# Altium schematic sheet Processor.SchDoc
size A
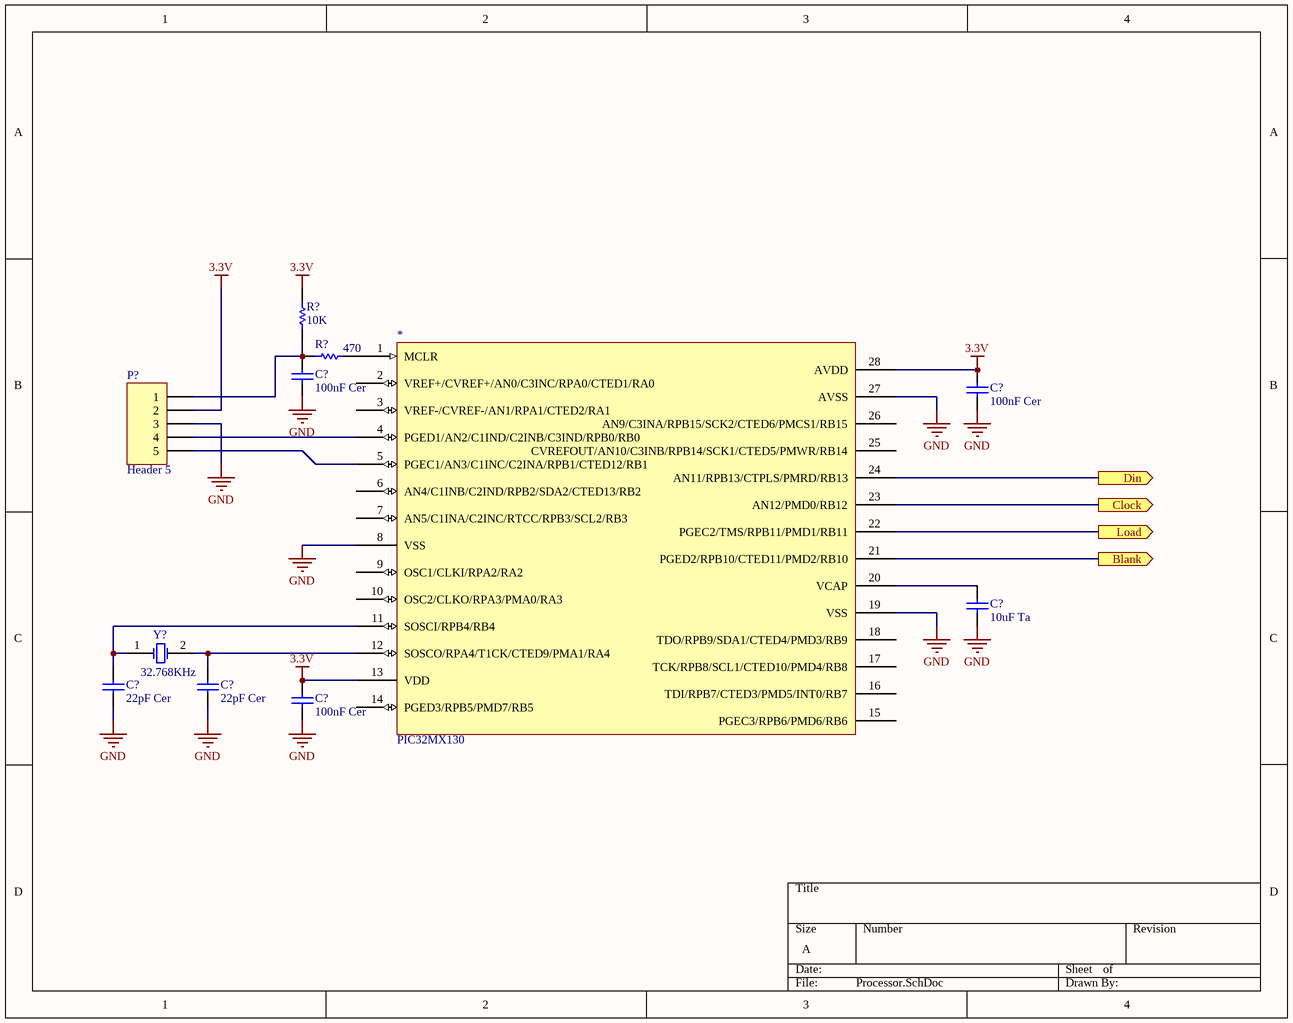
[diagram p0: Processor.SchDoc]

## Parts
(Parts that share a designator on the sheet are numbered #1, #2 ... from top to bottom, then left to right.)
*  PIC32MX130
C?#1  100nF Cer  [RAD-0.3]
C?#2  100nF Cer  [RAD-0.3]
C?#3  10uF Ta  [RAD-0.3]
C?#4  22pF Cer  [RAD-0.3]
C?#5  22pF Cer  [RAD-0.3]
C?#6  100nF Cer  [RAD-0.3]
P?  Header 5  [HDR1X5]
R?#1  10K  [AXIAL-0.3]
R?#2  470  [AXIAL-0.3]
Y?  32.768KHz  [R38]

## Ports
Blank (out), Clock (out), Din (out), Load (out)

## Nets
3.3V: *.13(VDD) *.28(AVDD) C?#2.2 C?#6.2 P?.2 R?#1.2
GND: *.8(VSS) *.19(VSS) *.27(AVSS) C?#1.1 C?#2.1 C?#3.1 C?#4.1 C?#5.1 C?#6.1 P?.3
Blank: *.21(PGED2/RPB10/CTED11/PMD2/RB10) ; port Blank
Clock: *.23(AN12/PMD0/RB12) ; port Clock
Din: *.24(AN11/RPB13/CTPLS/PMRD/RB13) ; port Din
Load: *.22(PGEC2/TMS/RPB11/PMD1/RB11) ; port Load
Net*_1: *.1(MCLR) R?#2.1
Net*_4: *.4(PGED1/AN2/C1IND/C2INB/C3IND/RPB0/RB0) P?.4
Net*_5: *.5(PGEC1/AN3/C1INC/C2INA/RPB1/CTED12/RB1) P?.5
Net*_11: *.11(SOSCI/RPB4/RB4) C?#4.2 Y?.1(OSC1)
Net*_12: *.12(SOSCO/RPA4/T1CK/CTED9/PMA1/RA4) C?#5.2 Y?.2(OSC2)
Net*_20: *.20(VCAP) C?#3.2
NetC?#1_2: C?#1.2 P?.1 R?#1.1 R?#2.2

Not connected (* = marked no-connect by the designer): * 2(VREF+/CVREF+/AN0/C3INC/RPA0/CTED1/RA0) 3(VREF-/CVREF-/AN1/RPA1/CTED2/RA1) 6(AN4/C1INB/C2IND/RPB2/SDA2/CTED13/RB2) 7(AN5/C1INA/C2INC/RTCC/RPB3/SCL2/RB3) 9(OSC1/CLKI/RPA2/RA2) 10(OSC2/CLKO/RPA3/PMA0/RA3) 14(PGED3/RPB5/PMD7/RB5) 15(PGEC3/RPB6/PMD6/RB6) 16(TDI/RPB7/CTED3/PMD5/INT0/RB7) 17(TCK/RPB8/SCL1/CTED10/PMD4/RB8) 18(TDO/RPB9/SDA1/CTED4/PMD3/RB9) 25(CVREFOUT/AN10/C3INB/RPB14/SCK1/CTED5/PMWR/RB14) 26(AN9/C3INA/RPB15/SCK2/CTED6/PMCS1/RB15)

## Library data of the parts
C?#1-C?#6 = Cap: Capacitor; Value: 100pF; Published: 8-Jun-2000; LatestRevisionDate: 17-Jul-2002; LatestRevisionNote: Re-released for DXP Platform.; PackageReference: RAD-0.3; Publisher: Altium Limited; PackageDescription: Radial Cap, Thru-Hole; 2 Leads; 0.3 in Pin Spacing
P? = Header 5: Header, 5-Pin; LatestRevisionDate: 17-Jul-2002; LatestRevisionNote: Re-released for DXP Platform.; Publisher: Altium Limited
R?#1 R?#2 = Res1: Resistor; Value: 1K; Published: 8-Jun-2000; LatestRevisionDate: 17-Jul-2002; LatestRevisionNote: Re-released for DXP Platform.; PackageReference: AXIAL-0.3; Publisher: Altium Limited; PackageDescription: Axial Device, Thru-Hole; 2 Leads; 0.3 in Pin Spacing
Y? = XTAL: Crystal Oscillator; Published: 8-Jun-2000; LatestRevisionDate: 17-Jul-2002; LatestRevisionNote: Re-released for DXP Platform.; PackageReference: R38; Publisher: Altium Limited; PackageDescription: Crystal, Thru-Hole; 2 Leads; Body 3.1 x 8.2 mm (Dia.xH)